# Altium schematic sheet IDX_CTRL.SchDoc: FMC_ADC
size 420 x 297 mm; Author: G.Kasprowicz; CompanyName: WUT ISE; DrawnBy: G.Kasprowicz; Organization: WUT ISE; Address1: PW ISE; Address2: Nowowiejska 15/19 00-665 Warsaw; Address3: gkasprow@gmail.com; DocumentNumber: 8; Revision: 2; SheetNumber: 8; SheetTotal: 12; ModifiedBy: -; CheckedDate: -; Title2: TDC INDEX signal distribution; DivGrp: WUT ISE; Designer: G.Kasprowicz; ModifiedDate: -; ProjectName: Sensor Box
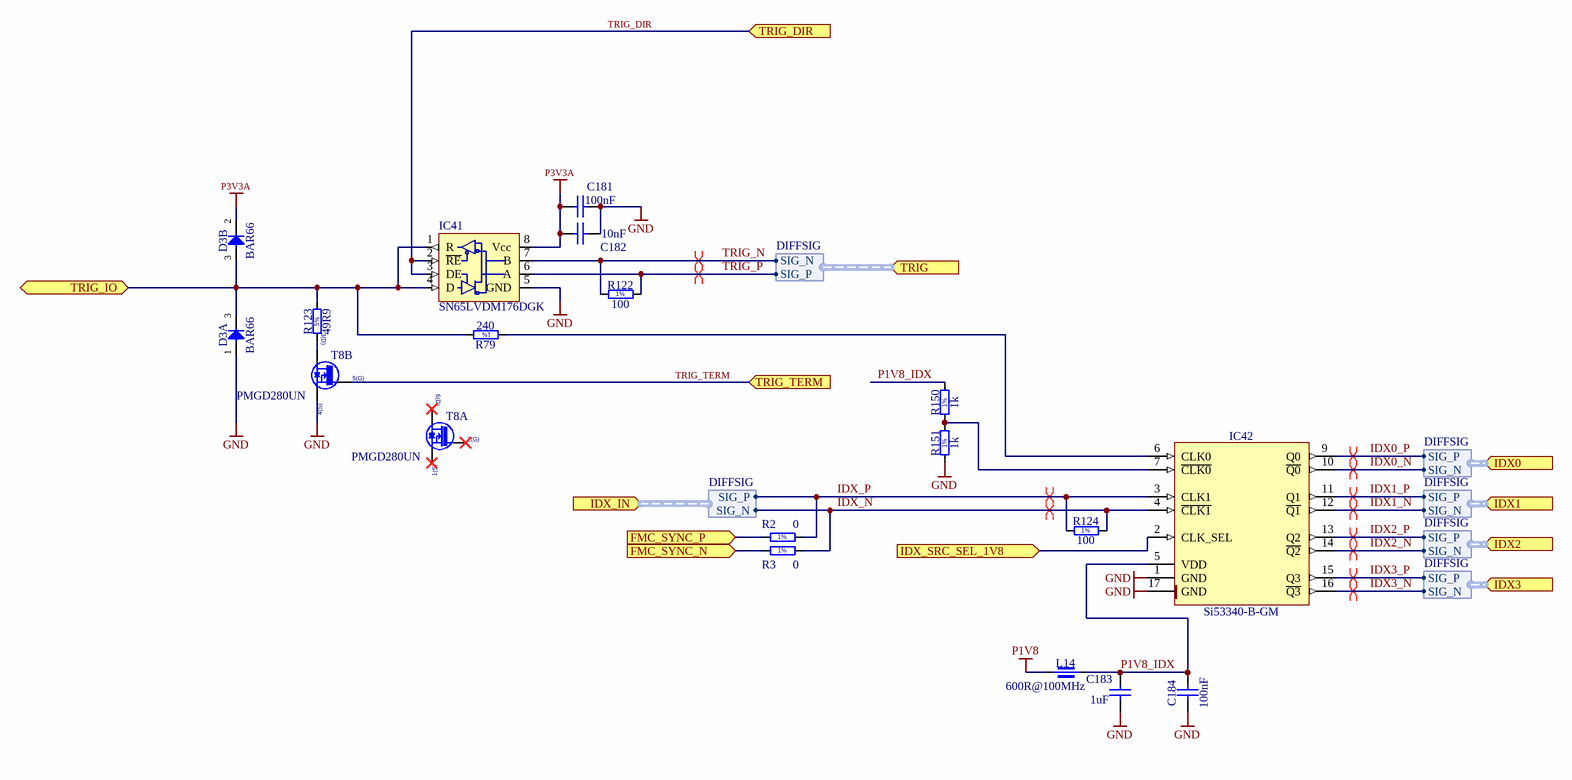
[diagram p0: IDX_CTRL.SchDoc]

## Parts
C181  100nF  [CAPC0603X33N]
C182  10nF  [CAPC0603X33N]
C183  1uF  [CAPC1005X55N]
C184  100nF  [CAPC0603X33N]
D3  BAR66  [SOT95P240X110-3N]  (parts A,B of 2)
IC41  SN65LVDM176DGK  [MSOP8 TI/AD]
IC42  Si53340-B-GM  [QFN50P300X300X90-17N-S175]
L14  600R@100MHz  [INDC1005X55N]
R2  0  [RESC1005X40N]
R3  0  [RESC1005X40N]
R79  240  [RESC1005X40N]
R122  100  [RESC0603X28N]
R123  49R9  [RESC3225X70N]
R124  100  [RESC0603X28N]
R150  1k  [RESC1005X40N]
R151  1k  [RESC1005X40N]
T8  PMGD280UN  [SOT65P210X110-6N]  (parts A,B of 2)

## Ports
FMC_SYNC_N (in), FMC_SYNC_P (in), IDX0 (in, harness DIFFSIG), IDX1 (in, harness DIFFSIG), IDX2 (in, harness DIFFSIG), IDX3 (in, harness DIFFSIG), IDX_IN (in, harness DIFFSIG), IDX_SRC_SEL_1V8 (in), TRIG (in, harness DIFFSIG), TRIG_DIR (in), TRIG_IO (bidir), TRIG_TERM (in)

## Harnesses
DIFFSIG: SIG_N, SIG_P

## Nets
GND: C181.2 C182.2 C183.1 C184.1 D3.1(A) IC41.5(GND) IC42.1(GND) IC42.17(GND) R151.1 T8.4(S)
P1V8: L14.1
P3V3A: C181.1 C182.1 D3.2(C) IC41.8(Vcc)
FMC_SYNC_N: R3.1 ; port FMC_SYNC_N
FMC_SYNC_P: R2.1 ; port FMC_SYNC_P
IDX0_N: IC42.10(~{Q0}) ; port IDX0.SIG_N
IDX0_P: IC42.9(Q0) ; port IDX0.SIG_P
IDX1_N: IC42.12(~{Q1}) ; port IDX1.SIG_N
IDX1_P: IC42.11(Q1) ; port IDX1.SIG_P
IDX2_N: IC42.14(~{Q2}) ; port IDX2.SIG_N
IDX2_P: IC42.13(Q2) ; port IDX2.SIG_P
IDX3_N: IC42.16(~{Q3}) ; port IDX3.SIG_N
IDX3_P: IC42.15(Q3) ; port IDX3.SIG_P
IDX_N: IC42.4(~{CLK1}) R3.2 R124.2 ; port IDX_IN.SIG_N
IDX_P: IC42.3(CLK1) R2.2 R124.1 ; port IDX_IN.SIG_P
IDX_SRC_SEL_1V8: IC42.2(CLK_SEL) ; port IDX_SRC_SEL_1V8
P1V8_IDX: C183.2 C184.2 IC42.5(VDD) L14.2 R150.2
TRIG_DIR: IC41.2(~{RE}) IC41.3(DE) ; port TRIG_DIR
TRIG_IO: D3.3(COMAC) IC41.1(R) IC41.4(D) R79.2 R123.2 ; port TRIG_IO
TRIG_N: IC41.7(B) R122.1 ; port TRIG.SIG_N
TRIG_P: IC41.6(A) R122.2 ; port TRIG.SIG_P
TRIG_TERM: T8.5(G) ; port TRIG_TERM
NetIC42_6: IC42.6(CLK0) R79.1
NetIC42_7: IC42.7(~{CLK0}) R150.1 R151.2
NetR123_1: R123.1 T8.3(D)

Not connected (* = marked no-connect by the designer): T8 1(S)* 2(G)* 6(D)*

## Layout directives
differential pair: IDX0_N, IDX0_P, IDX1_N, IDX1_P, IDX2_N, IDX2_P, IDX3_N, IDX3_P, IDX_N, IDX_P, TRIG_N, TRIG_P

## Notes on the sheet
- Project/Equipment
- Document
- Designer
- Drawn by
- Check.by
- Copyright WUT ISE 2018.
  This documentation describes Open Hardware and is licensed under the CERN OHL v.1.1. You may redistribute and modify this documentation under the terms of the CERN OHL v.1.1. (http://ohwr.org/CERNOHL). This documentation is distributed WITHOUT ANY EXPRESS OR IMPLIED WARRANTY, INCLUDING OF MERCHANTABILITY, SATISFACTORY QUALITY AND FITNESS FOR A PARTICULAR PURPOSE. Please see the CERN OHL v.1.1 for applicable conditions.
- Contact
- File
- Last Mod.
- Print Date
- Sheet
- Size
- A3
- of
- Rev
- (in symbol PMGD280UN, part A) 6(D); 2(G); 1(S)
- (in symbol PMGD280UN, part B) 3(D); 5(G); 4(S)
- (in symbol R0201_100R_1%_0.05W_200PPM) 1%
- (in symbol R0402_0R_JUMPER) 1%
- (in symbol R0402_1K_1%_0.0625W_100PPM) 1%
- (in symbol R0402_240R_1%_0.0625W_100PPM) 1%
- (in symbol R1210_270R_5%_0.5W_200PPM) 5%

## Library data of the parts
C181 = CC0201_100NF_6.3V_10%_X5R: Non-polarised capacitor; Part Description: SMD Multilayer Chip Ceramic Capacitor; Manufacturer: GENERIC; Manufacturer1 Part Number: 02016D104KAT2A; Voltage: 6.3V; TC: X5R; Tolerance: ±10%; Table: Capacitors SMD; Part Number: CC0201_100NF_6.3V_10%_X5R; Component Kind: Standard; Component Type: Standard; Pin Count: 2; Value: 100nF; Status: Not Recommended; Manufacturer Part Number: CC0201_100NF_6.3V_10%_X5R; Case: 0201; Mounted: Yes; Socket: No; SMD: Yes; Manufacturer1 Example: AVX; Manufacturer1 ComponentHeight: 0.33mm; HelpURL: \\cern.ch\dfs\Applications\Altium\Datasheets\CC0201_X5R_AVX.pdf; Author: CERN DEM JLC; CreateDate: 2007-12-03; LatestRevisionDate: 2007-12-03
C182 = CC0201_10NF_10V_10%_X5R: Non-polarised capacitor; Part Description: SMD Multilayer Chip Ceramic Capacitor; Manufacturer: GENERIC; Manufacturer1 Part Number: 0201ZD103KAT2A; Voltage: 10V; TC: X5R; Tolerance: ±10%; Table: Capacitors SMD; Part Number: CC0201_10NF_10V_10%_X5R; Component Kind: Standard; Component Type: Standard; Pin Count: 2; Value: 10nF; Status: Not Recommended; Manufacturer Part Number: CC0201_10NF_10V_10%_X5R; Case: 0201; Mounted: Yes; Socket: No; SMD: Yes; Manufacturer1 Example: AVX; Manufacturer1 ComponentHeight: 0.33mm; HelpURL: \\cern.ch\dfs\Applications\Altium\Datasheets\CC0201_X5R_AVX.pdf; Author: CERN DEM JLC; CreateDate: 2007-12-03; LatestRevisionDate: 2007-12-03
C183 = CC0402_1UF_16V_10%_X5R: Non-polarised capacitor; Part Description: SMD Multilayer Chip Ceramic Capacitor; Manufacturer: GENERIC; Manufacturer1 Part Number: C1005X5R1C105KT; Voltage: 16V; TC: X5R; Tolerance: ±10%; Part Number: CC0402_1UF_16V_10%_X5R; Component Kind: Standard; Component Type: Standard; Pin Count: 2; Value: 1uF; Status: Preferred; Manufacturer Part Number: CC0402_1UF_16V_10%_X5R; Case: 0402; Mounted: Yes; Socket: No; SMD: Yes; Sense: No; Manufacturer1 Example: TDK; Manufacturer1 ComponentHeight: 0.55mm; HelpURL: \\cern.ch\dfs\Applications\Altium\Datasheets\CC0402_X5R_TDK_C.pdf; Author: CERN DEM JLC; CreateDate: 2012-10-25; LatestRevisionDate: 2012-10-25
C184 = CC0201_100NF_6.3V_10%_X5R: Non-polarised capacitor; Part Description: SMD Multilayer Chip Ceramic Capacitor; Manufacturer: GENERIC; Manufacturer1 Part Number: 02016D104KAT2A; Voltage: 6.3V; TC: X5R; Tolerance: ±10%; Part Number: CC0201_100NF_6.3V_10%_X5R; Component Kind: Standard; Component Type: Standard; Pin Count: 2; Value: 100nF; Status: Not Recommended; Manufacturer Part Number: CC0201_100NF_6.3V_10%_X5R; Case: 0201; Mounted: Yes; Socket: No; SMD: Yes; Sense: No; Manufacturer1 Example: AVX; Manufacturer1 ComponentHeight: 0.33mm; HelpURL: \\cern.ch\dfs\Applications\Altium\Datasheets\CC0201_X5R_AVX.pdf; Author: CERN DEM JLC; CreateDate: 03.12.2007; LatestRevisionDate: 03.12.2007
D3 = BAR66: Serial Diode; Part Description: Silicon PIN Diode Array (Series Connected); Manufacturer: INFINEON; Voltage: 150V; Power: 250mA; Table: Diodes; Part Number: BAR66; Component Kind: Standard; Component Type: Standard; Device: BAR66; PackageDescription: SOT23 3-Leads, Pitch 0.95mm - Body 1.3x2.9mm, IPC Medium Density; Manufacturer Part Number: BAR66; Pin Count: 3; Case: SOT23; Mounted: Yes; Socket: No; SMD: Yes; ComponentHeight: 1.1mm; HelpURL: \\cern.ch\dfs\Applications\Altium\Datasheets\BAR66.pdf; Author: CERN DEM JLC; CreateDate: 18/1/2010; LatestRevisionDate: 5/10/2010
IC41 = SN65LVDM176: High Speed Differential Transceiver LVDS/LVTTL; ComponentLink1Description: Datasheet; ComponentLink1URL: C:\TSR\Laurin\Projects\FMC\CERN DAC\Parts\Digital\SN65LVDM176.pdf
IC42 = Si53340-B-GM: Low-Jitter LVDS Fanout Clock Buffers, 10-Output,  Any-Input, Any-Frequency up to 1250MHz; Manufacturer: SILICON LABS; PressFit: No; Bonding: No; Part Number: Si53340-B-GM; Component Kind: Standard; Component Type: Standard; Device: Si53340-B-GM; PackageDescription: QFN, 0.50mm Pitch, Square; 16 Pin, 3.00mm L X 3.00mm W X 0.90mm H Body (w/thermal tab 1.75mm x 1.75mm), IPC Medium Density; Part Description: Low-Jitter LVDS Fanout Clock Buffers, 10-Output,  Any-Input, Any-Frequency up to 1250MHz; Manufacturer Part Number: Si53340-B-GM; Pin Count: 17; Case: QFN16; Mounted: Yes; Socket: No; SMD: Yes; Sense: No; ComponentHeight: 0.9mm; HelpURL: \\cern.ch\dfs\Applications\Altium\Datasheets\Si53340-B-GM.pdf; Author: CERN DEM MR; CreateDate: 04.09.2017; LatestRevisionDate: 04.09.2017
L14 = IND0402_MURATA_BLM15HD601SN1: Part Description: SMD EMIFIL Suppression Chip Ferrite Bead; Manufacturer: MURATA; Manufacturer Part Number: BLM15HD601SN1D; Power: 300mA; Resistance: 0.85R; Tolerance: ±25%; Part Number: IND0402_MURATA_BLM15HD601SN1; Component Kind: Standard; Component Type: Standard; Pin Count: 2; Value: 600R@100MHz; Status: None; Case: 0402; Mounted: Yes; Socket: No; SMD: Yes; Sense: No; ComponentHeight: 0.55mm; HelpURL: \\cern.ch\dfs\Applications\Altium\Datasheets\IND0402_MURATA_BLM15H.pdf; Author: CERN DEM JLC; CreateDate: 28.02.2012; LatestRevisionDate: 25.10.2018
R2 R3 = R0402_0R_JUMPER: Resistor - 1%; Part Description: 1A (0.05R Max DC Resistance) Zero Ohm Jumper; Manufacturer: GENERIC; Manufacturer1 Part Number: 232270591001L; Table: Resistors SMD; Part Number: R0402_0R_JUMPER; Component Kind: Standard; Component Type: Standard; Pin Count: 2; Value: 0; Status: Not recommended; Manufacturer Part Number: R0402_0R_JUMPER; Case: 0402; Mounted: Yes; Socket: No; SMD: Yes; Manufacturer1 Example: YAGEO PHYCOMP; Manufacturer1 ComponentHeight: 0.4mm; HelpURL: \\cern.ch\dfs\Applications\Altium\Datasheets\R0402_Phycomp_RC0402.pdf; Author: CERN DEM JLC; CreateDate: 3/12/2007; LatestRevisionDate: 17/10/2012
R79 = R0402_240R_1%_0.0625W_100PPM: Resistor - 1%; Part Description: General Purpose Thick Film Chip Resistor; Manufacturer: GENERIC; Manufacturer1 Part Number: 232270672401L; TC: ±100ppm/°C; PressFit: No; Part Number: R0402_240R_1%_0.0625W_100PPM; Component Kind: Standard; Component Type: Standard; Pin Count: 2; Value: 240; Status: Not Recommended; Power: 0.0625W; Tolerance: ±1%; Manufacturer Part Number: R0402_240R_1%_0.0625W_100PPM; Case: 0402; Mounted: Yes; Sense: No; Socket: No; SMD: Yes; Manufacturer1 Example: YAGEO PHYCOMP; Manufacturer1 ComponentHeight: 0.4mm; HelpURL: \\cern.ch\dfs\Applications\Altium\Datasheets\R0402_Phycomp_RC0402.pdf; Author: CERN DEM JLC; CreateDate: 03.12.2007; LatestRevisionDate: 17.10.2012
R122 R124 = R0201_100R_1%_0.05W_200PPM: Resistor - 1%; Part Description: Thick Film Chip Resistor; Manufacturer: GENERIC; Manufacturer1 Part Number: CRCW0201100RFNED; Power: 0.05W; TC: ±200ppm/°C; PressFit: No; Part Number: R0201_100R_1%_0.05W_200PPM; Component Kind: Standard; Component Type: Standard; Pin Count: 2; Value: 100; Status: Not Recommended; Tolerance: ±1%; Manufacturer Part Number: R0201_100R_1%_0.05W_200PPM; Case: 0201; Mounted: Yes; Socket: No; SMD: Yes; Manufacturer1 Example: VISHAY; Manufacturer1 ComponentHeight: 0.27mm; HelpURL: \\cern.ch\dfs\Applications\Altium\Datasheets\R0201_VISHAY_CRCW0201 e3.pdf; Author: CERN DEM JLC; CreateDate: 13.11.2014; LatestRevisionDate: 13.11.2014; Sense: No
R123 = R1210_270R_5%_0.5W_200PPM: Resistor - 5%; Part Number: R1210_49R9_1%_0.33W_100PPM; Part Description: General Purpose Thick Film Chip Resistor; Manufacturer: VISHAY; Manufacturer Part Number: CRCW121049R9FK; Power: 0.33W; TC: ±100ppm/°C; Table: Resistors SMD; Component Kind: Standard; Component Type: Standard; Pin Count: 2; Value: 49R9; Status: None; Tolerance: ±5%; Case: 1210; Mounted: Yes; Socket: No; SMD: Yes; ComponentHeight: 0.7mm; HelpURL: \\cern.ch\dfs\Applications\Altium\Datasheets\R1210_PANASONIC_ERJ.pdf; Author: CERN DEM JLC; CreateDate: 2011-10-26; LatestRevisionDate: 2011-10-26
R150 R151 = R0402_1K_1%_0.0625W_100PPM: Resistor - 1%; Part Description: General Purpose Thick Film Chip Resistor; Manufacturer: GENERIC; Manufacturer1 Part Number: 232270671002L; TC: ±100ppm/°C; Tolerance: ±1%; Value: 1k; Power: 0.0625W; Part Number: R0402_1K_1%_0.0625W_100PPM; Component Kind: Standard; Component Type: Standard; Pin Count: 2; Status: Not recommended; Manufacturer Part Number: R0402_1K_1%_0.0625W_100PPM; Case: 0402; Mounted: Yes; Sense: No; Socket: No; SMD: Yes; Manufacturer1 Example: YAGEO PHYCOMP; Manufacturer1 ComponentHeight: 0.4mm; HelpURL: \\cern.ch\dfs\Applications\Altium\Datasheets\R0402_Phycomp_RC0402.pdf; Author: CERN DEM JLC; CreateDate: 03.12.2007; LatestRevisionDate: 17.10.2012
T8 = PMGD280UN: Dual N-Channel micro TrenchMOS™ Ultra Low Level FET; Part Description: 20V 870mA Dual N-Channel micro TrenchMOS™ Ultra Low Level FET; Manufacturer: NXP SEMICONDUCTORS; PressFit: No; Bonding: No; Part Number: PMGD280UN; Component Kind: Standard; Component Type: Standard; Device: PMGD280UN; PackageDescription: SOT363, SC70-6, SOT, 0.65mm Pitch, 6 pin, 1.25mm W X 2.00mm L X 1.10mm H, IPC Medium Density; Manufacturer Part Number: PMGD280UN; Pin Count: 6; Case: SOT363; Mounted: Yes; Socket: No; SMD: Yes; Sense: No; ComponentHeight: 1.1mm; HelpURL: \\cern.ch\dfs\Applications\Altium\Datasheets\PMGD280UN.pdf; Author: CERN DEM JLC; CreateDate: 19.11.2014; LatestRevisionDate: 19.11.2014